# Altium schematic sheet 6 Bluetooth.SchDoc
size B; DocumentNumber: 6; SheetNumber: 6; SheetTotal: 17
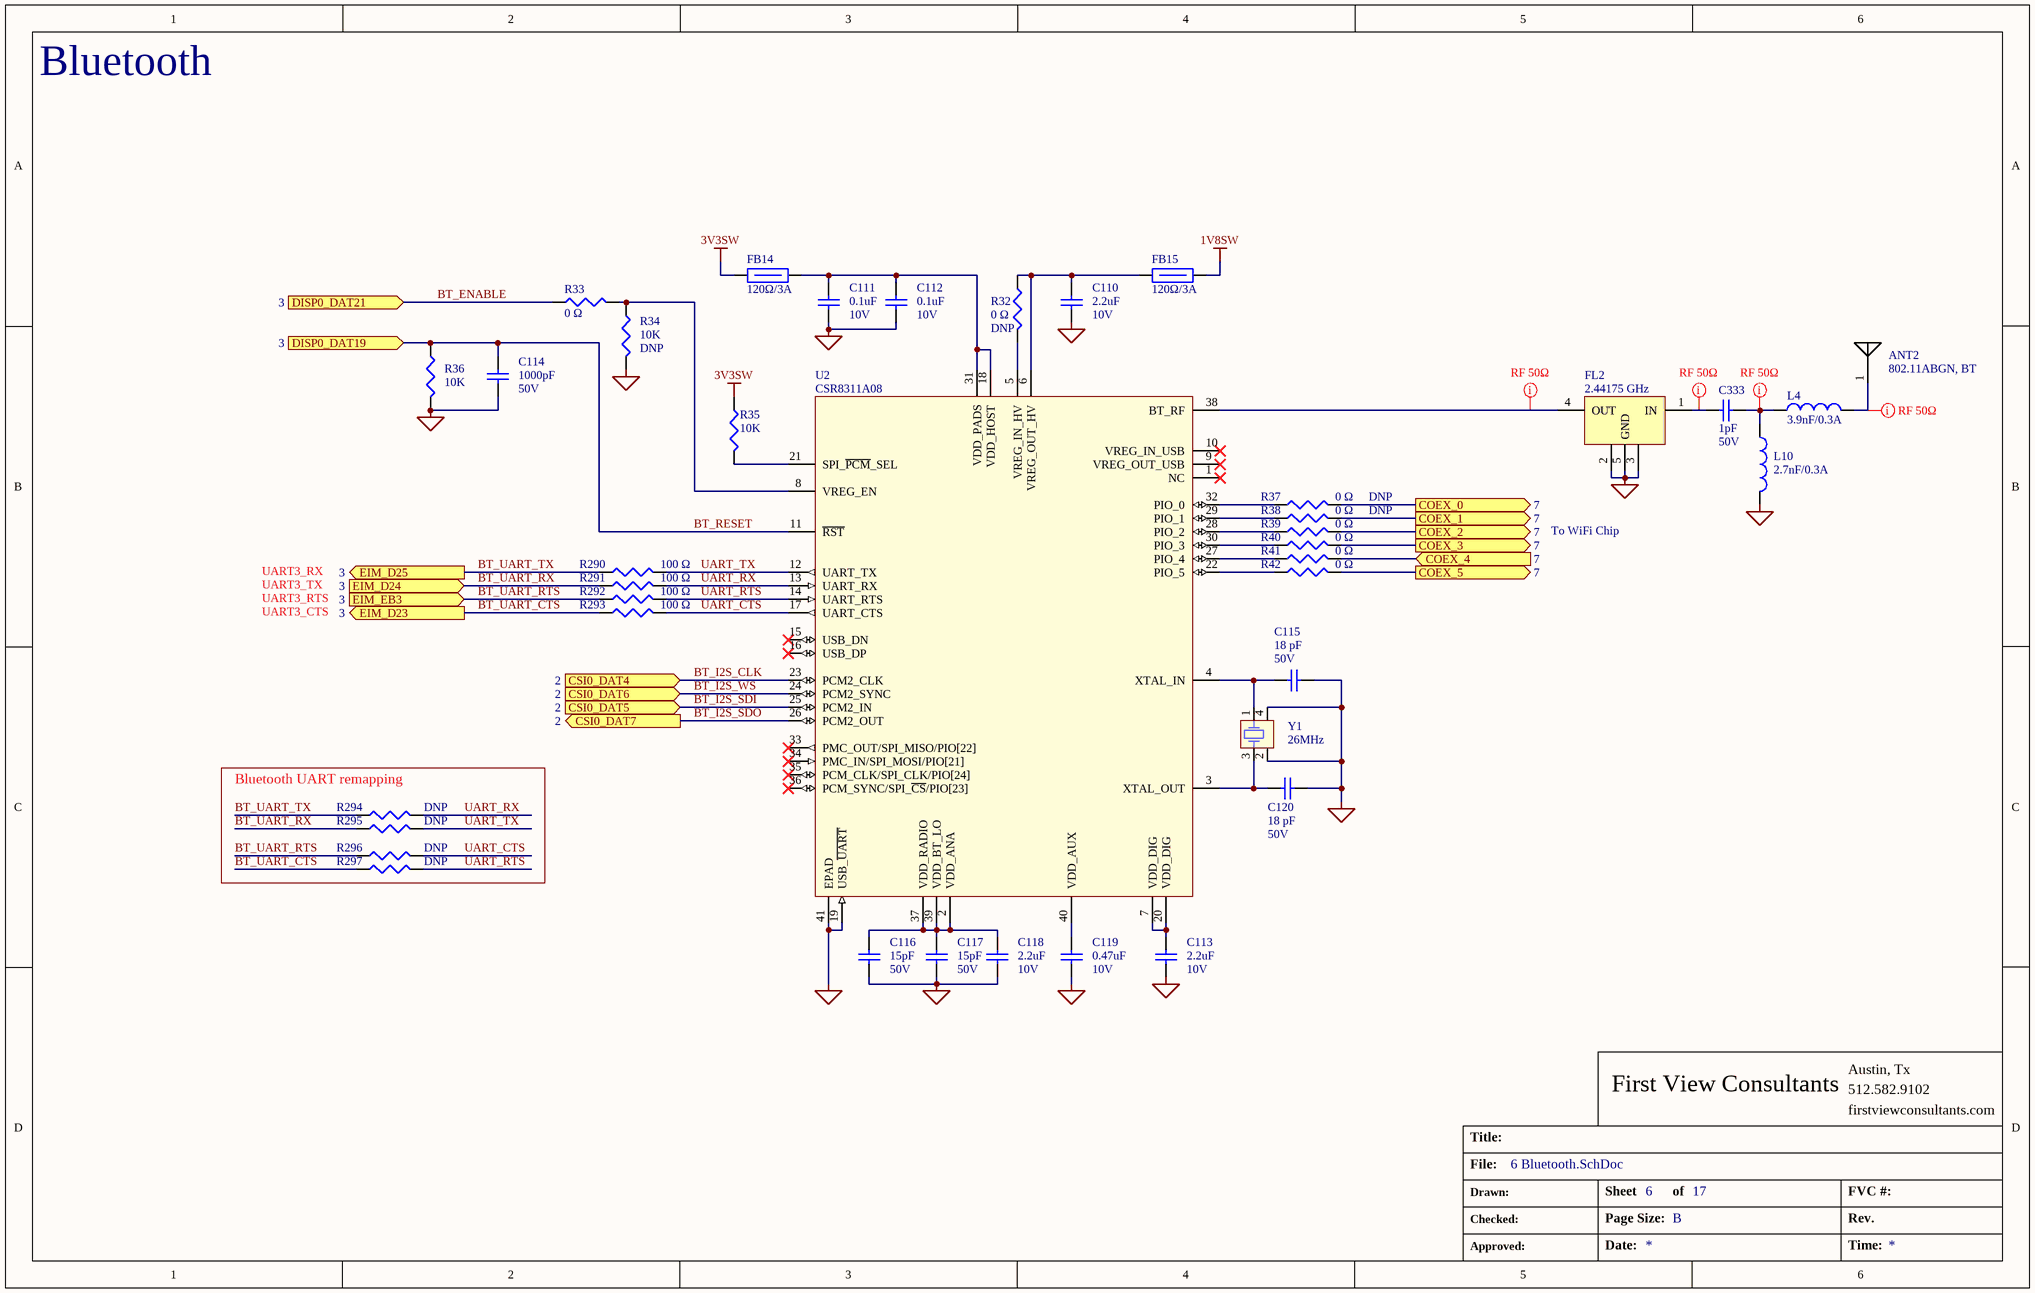
[diagram p0: 6 Bluetooth.SchDoc]

## Parts
ANT2  value 802.11ABGN, BT  [ANT_2450AT18A100E]  (hidden comment: 2450AT18A100E)
C110  value 2.2uF  Voltage: 10V  [CAP_0402]  (hidden comment: Cap 2.2uF 10V 0402)
C111  value 0.1uF  Voltage: 10V  [CAP_0402]  (hidden comment: Cap 0.1uF 10V 0402)
C112  value 0.1uF  Voltage: 10V  [CAP_0402]  (hidden comment: Cap 0.1uF 10V 0402)
C113  value 2.2uF  Voltage: 10V  [CAP_0402]  (hidden comment: Cap 2.2uF 10V 0402)
C114  value 1000pF  Voltage: 50V  [CAP_0603]  (hidden comment: Cap 1000pF 50V 0603)
C115  value 18 pF  Voltage: 50V  [CAP_0402]  (hidden comment: Cap 18pF 50V 0402)
C116  value 15pF  Voltage: 50V  [CAP_0402]  (hidden comment: Cap 15pF 50V 0402)
C117  value 15pF  Voltage: 50V  [CAP_0402]  (hidden comment: Cap 15pF 50V 0402)
C118  value 2.2uF  Voltage: 10V  [CAP_0402]  (hidden comment: Cap 2.2uF 10V 0402)
C119  value 0.47uF  Voltage: 10V  [CAP_0402]  (hidden comment: Cap 0.47uF 10V 0402)
C120  value 18 pF  Voltage: 50V  [CAP_0402]  (hidden comment: Cap 18pF 50V 0402)
C333  value 1pF  Voltage: 50V  [CAP_0402]  (hidden comment: Cap 1pF 50V 0402 RF)
FB14  value 120Ω/3A  [IND_0603]  (hidden comment: BLM18KG121TN1D)
FB15  value 120Ω/3A  [IND_0603]  (hidden comment: BLM18KG121TN1D)
FL2  value 2.44175 GHz  [SMD(1.3x1.1)_B39242B9413K610]  (hidden comment: B39242B9413K610)
L4  value 3.9nF/0.3A  [IND_RF_0402]  (hidden comment: L-07C3N9SV6T)
L10  value 2.7nF/0.3A  [IND_RF_0402]  (hidden comment: L-07C2N7SV6T)
R32  value 0 Ω  [RES_0402]  (hidden comment: Res 0 ohm 0.1W)
R33  value 0 Ω  [RES_0402]  (hidden comment: Res 0 ohm 0.1W)
R34  value 10K  [RES_0402]  (hidden comment: Res 10K 0.063W)
R35  value 10K  [RES_0402]  (hidden comment: Res 10K 0.063W)
R36  value 10K  [RES_0402]  (hidden comment: Res 10K 0.063W)
R37  value 0 Ω  [RES_0402]  (hidden comment: Res 0 ohm 0.1W)
R38  value 0 Ω  [RES_0402]  (hidden comment: Res 0 ohm 0.1W)
R39  value 0 Ω  [RES_0402]  (hidden comment: Res 0 ohm 0.1W)
R40  value 0 Ω  [RES_0402]  (hidden comment: Res 0 ohm 0.1W)
R41  value 0 Ω  [RES_0402]  (hidden comment: Res 0 ohm 0.1W)
R42  value 0 Ω  [RES_0402]  (hidden comment: Res 0 ohm 0.1W)
R290  value 100 Ω  [RES_0402]  (hidden comment: Res 100R 0.063W)
R291  value 100 Ω  [RES_0402]  (hidden comment: Res 100R 0.063W)
R292  value 100 Ω  [RES_0402]  (hidden comment: Res 100R 0.063W)
R293  value 100 Ω  [RES_0402]  (hidden comment: Res 100R 0.063W)
R294  Res 0 ohm 0.1W DNP  [RES_0402]  (value not drawn)
R295  Res 0 ohm 0.1W DNP  [RES_0402]  (value not drawn)
R296  Res 0 ohm 0.1W DNP  [RES_0402]  (value not drawn)
R297  Res 0 ohm 0.1W DNP  [RES_0402]  (value not drawn)
U2  CSR8311A08  [QFN-40_CSR8311A08]
Y1  value 26MHz  [DFN(3.2x2.5)_403I35D26M00000]  (hidden comment: 403I35D26M00000)

## Blocks framed on the sheet
Bluetooth UART remapping: R294-R297

## Ports
COEX_0 (out, see 7), COEX_1 (out, see 7), COEX_2 (out, see 7), COEX_3 (out, see 7), COEX_4 (in, see 7), COEX_5 (out, see 7), CSI0_DAT4 (in, see 2), CSI0_DAT5 (in, see 2), CSI0_DAT6 (in, see 2), CSI0_DAT7 (out, see 2), DISP0_DAT19 (in, see 3), DISP0_DAT21 (in, see 3), EIM_D23 (out, see 3), EIM_D24 (in, see 3), EIM_D25 (out, see 3), EIM_EB3 (in, see 3)

## Nets
1V8SW: FB15.2
3V3SW: FB14.1 R35.1
GND: C110.2 C111.2 C112.2 C113.2 C114.2 C115.1 C116.2 C117.2 C118.2 C119.2 C120.1 FL2.2(GND) FL2.3(GND) FL2.5(GND) L10.2 R34.2 R36.2 U2.19(USB_~{UART}) U2.41(EPAD) Y1.2 Y1.4
BT_ENABLE: R33.1 ; port DISP0_DAT21
BT_I2S_CLK: U2.23(PCM2_CLK) ; port CSI0_DAT4
BT_I2S_SDI: U2.25(PCM2_IN) ; port CSI0_DAT5
BT_I2S_SDO: U2.26(PCM2_OUT) ; port CSI0_DAT7
BT_I2S_WS: U2.24(PCM2_SYNC) ; port CSI0_DAT6
BT_RESET: C114.1 R36.1 U2.11(~{RST}) ; port DISP0_DAT19
BT_UART_CTS: R293.1 R297.1 ; port EIM_D23
BT_UART_RTS: R292.1 R296.1 ; port EIM_EB3
BT_UART_RX: R291.1 R295.1 ; port EIM_D24
BT_UART_TX: R290.1 R294.1 ; port EIM_D25
COEX_0: R37.2 ; port COEX_0
COEX_1: R38.2 ; port COEX_1
COEX_2: R39.2 ; port COEX_2
COEX_3: R40.2 ; port COEX_3
COEX_4: R41.2 ; port COEX_4
COEX_5: R42.2 ; port COEX_5
UART_CTS: R293.2 R296.2 U2.17(UART_CTS)
UART_RTS: R292.2 R297.2 U2.14(UART_RTS)
UART_RX: R291.2 R294.2 U2.13(UART_RX)
UART_TX: R290.2 R295.2 U2.12(UART_TX)
NetANT2_1: ANT2.1 L4.2
NetC110_1: C110.1 FB15.1 R32.1 U2.6(VREG_OUT_HV)
NetC111_1: C111.1 C112.1 FB14.2 U2.18(VDD_HOST) U2.31(VDD_PADS)
NetC113_1: C113.1 U2.7(VDD_DIG) U2.20(VDD_DIG)
NetC115_2: C115.2 U2.4(XTAL_IN) Y1.1(OSC1)
NetC116_1: C116.1 C117.1 C118.1 U2.2(VDD_ANA) U2.37(VDD_RADIO) U2.39(VDD_BT_LO)
NetC119_1: C119.1 U2.40(VDD_AUX)
NetC120_2: C120.2 U2.3(XTAL_OUT) Y1.3(OSC2)
NetC333_1: C333.1 FL2.1(IN)
NetC333_2: C333.2 L4.1 L10.1
NetFL2_4: FL2.4(OUT) U2.38(BT_RF)
NetR32_2: R32.2 U2.5(VREG_IN_HV)
NetR33_2: R33.2 R34.1 U2.8(VREG_EN)
NetR35_2: R35.2 U2.21(SPI_~{PCM}_SEL)
NetR37_1: R37.1 U2.32(PIO_0)
NetR38_1: R38.1 U2.29(PIO_1)
NetR39_1: R39.1 U2.28(PIO_2)
NetR40_1: R40.1 U2.30(PIO_3)
NetR41_1: R41.1 U2.27(PIO_4)
NetR42_1: R42.1 U2.22(PIO_5)

Not connected (* = marked no-connect by the designer): U2 1(NC)* 9(VREG_OUT_USB)* 10(VREG_IN_USB)* 15(USB_DN)* 16(USB_DP)* 33(PMC_OUT/SPI_MISO/PIO[22])* 34(PMC_IN/SPI_MOSI/PIO[21])* 35(PCM_CLK/SPI_CLK/PIO[24])* 36(PCM_SYNC/SPI_~{CS}/PIO[23])*

## Layout directives
net class RF 50ohm: NetANT2_1, NetC333_1, NetC333_2, NetFL2_4

## Notes on the sheet
- Bluetooth
- To WiFi Chip
- UART3_RX
- UART3_TX
- UART3_RTS
- UART3_CTS
- First View Consultants
- Austin, Tx
- 512.582.9102
- Title:
- File:
- firstviewconsultants.com
- Drawn:
- Checked:
- Sheet
- Page Size:
- of
- B
- FVC #:
- Rev.
- Approved:
- Date:
- Time:

## Library data of the parts
ANT2 = 2450AT18A100E: Antenna, WiFi/BT, SMD; Manufacturer: Johanson Technology, Inc.; Manufacturer #: 2450AT18A100E
C110 C113 C118 = Cap 2.2uF 10V 0402: Cap, Cer, 2.2uF, 10V, 10%, X5R, 0402; Manufacturer #: C0402C225M8PACTU; Manufacturer: Kemet; Have Footprint: yes; Package: 0402
C111 C112 = Cap 0.1uF 10V 0402: Cap, Cer, 0.1uF, 10V, 10%, X5R, 0402; Manufacturer: Murata Electronics North America; Manufacturer #: GRM155R61A104KA01J; Have Footprint: yes; Tolerance: ±10%; PACKAGE: 0402
C114 = Cap 1000pF 50V 0603: Cap, Cer, 1000pF, 50V, 10%, X7S, 0603; Manufacturer: Yageo; Manufacturer #: CC0603KRX7R9BB102; Have Footprint: yes; Tolerance: 10%; PACKAGE: 0402
C115 C120 = Cap 18pF 50V 0402: Cap, Cer, 18pF, 50V, 5%, C0G, 0402; Manufacturer #: C1005C0G1H180J050BA; Manufacturer: TDK Corporation; Have Footprint: yes; Package: 0402
C116 C117 = Cap 15pF 50V 0402: Cap, Cer, 15pF, 50V, 5%, C0G/NP0, 0402; Manufacturer: Murata Electronics North America; Manufacturer #: GRM1555C1H150JA01D; Have Footprint: yes; Tolerance: 5%; PACKAGE: 0402
C119 = Cap 0.47uF 10V 0402: Cap, Cer, 0.47uF, 10V, 10%, X5R, 0402; Manufacturer: TDK Corporation; Manufacturer #: C1005X5R1A474K050BB; Have Footprint: yes; Package: 0402; Tolerance: ±10%
C333 = Cap 1pF 50V 0402 RF: Cap, Cer, 0.1uF, 50V, 10%, X5R, 0402; Manufacturer #: CBR04C109C5GAC; Manufacturer: Kemet; Have Footprint: yes; Tolerance: ±10%; PACKAGE: 0402
FB14 FB15 = BLM18KG121TN1D: Ind, Ferrite Bead, 120R, 20mOhm, 3A, 0603; Manufacturer: Murata Electronics North America; Have Footprint: yes; RoHS: yes; Package: 0603; Manufacturer #: BLM18KG121TN1D
FL2 = B39242B9413K610: Filter, Saw, 2.44175 GHz, BT, SMD; Manufacturer: EPCOS (TDK); Package: SMD (1.4x1.1); RoHS: yes; Manufacturer #: B39242B9413K610
L4 = L-07C3N9SV6T: Ind, RF, 3.9nH, 0.3A, 220 mOhm, 0402; Manufacturer: Johanson Technology Inc; RoHS: yes; Operating Temperature: -40°C ~ 100°C; Package: 0402; Manufacturer #: L-07C3N9SV6T
L10 = L-07C2N7SV6T: Ind, RF, 2.7nH, 0.3A, 170 mOhm, 0402; Manufacturer: Johanson Technology Inc; RoHS: yes; Operating Temperature: -40°C ~ 100°C; Package: 0402; Manufacturer #: L-07C2N7SV6T
R32 R33 R37-R42 = Res 0 ohm 0.1W: Res, 0 ohm, 1/16W, 0402; Manufacturer #: CRCW04020000Z0ED; Manufacturer: Vishay Dale; Have Footprint: yes; Package: 0402
  R32 R37 R38: DNP: DNP
R34-R36 = Res 10K 0.063W: Res, 10K, 1/16W, 1%, 0402; Manufacturer #: RC0402FR-0710KL; Manufacturer: Yageo; Have Footprint: yes; Package: 0402
  R34: DNP: DNP
R290-R293 = Res 100R 0.063W: Res, 100R, 0.063W, 1%, 0402; Manufacturer #: TRR01MZPF1000; Manufacturer: Murata Electronics North America; Have Footprint: yes; Package: 0402
R294-R297 = Res 0 ohm 0.1W DNP: Res, 0 ohm, 1/16W, 0402; Manufacturer #: CRCW04020000Z0ED; Manufacturer: Vishay Dale; Have Footprint: yes; Value: 0 Ω; Package: 0402; DNP: DNP
U2 = CSR8311A08: IC, Bluetooth, 40-QFN; Manufacturer: CSR PLC; Manufacturer #: CSR8311A08-AQQD-R; Have Footprint: yes; Cost: 3.0048; Value: CSR8311A08; Package: QFN-40
Y1 = 403I35D26M00000: Clock, Crystal, 26MHz, 50ppm, 18pf, -40+85°C, SMD; Manufacturer: CTS-Frequency Controls; Package: DFN(3.2x2.5mm); Manufacturer #: 403I35D26M00000